# Altium schematic sheet FPGA_RGMII_Misc.SchDoc
size A3
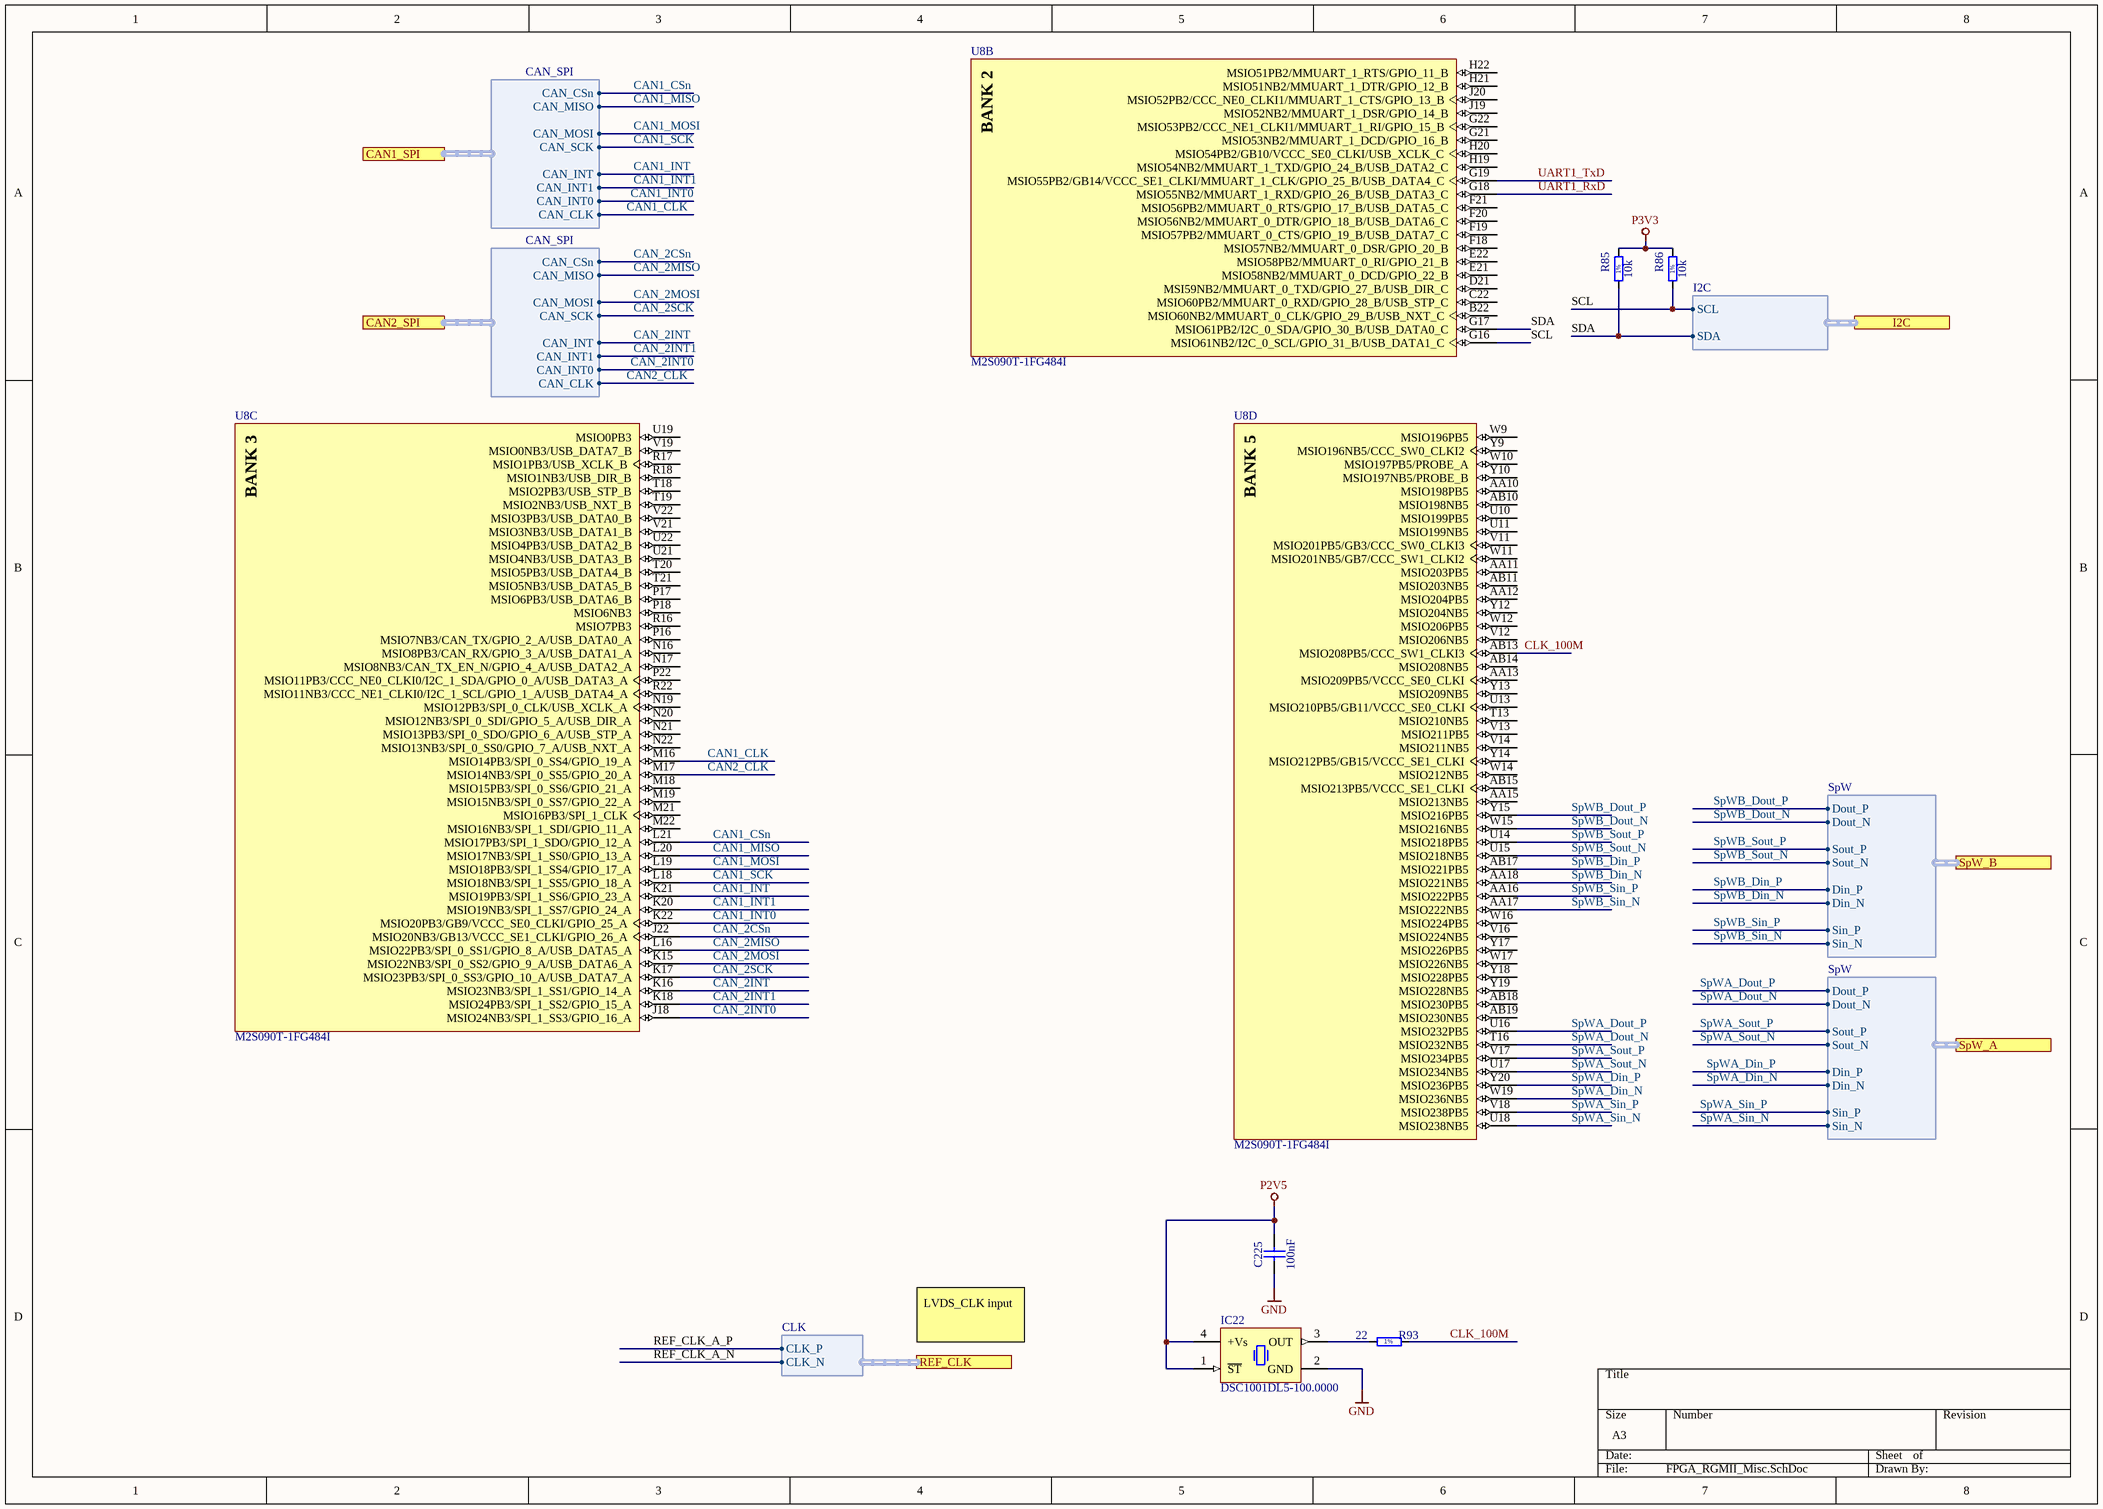
[diagram p0: FPGA_RGMII_Misc.SchDoc]

## Parts
C225  100nF  [CAPC0603X33N]
IC22  DSC1001DL5-100.0000  [OSC_MICREL_2520]
R85  10k  [RESC1005X40N]
R86  10k  [RESC1005X40N]
R93  22  [RESC1005X40N]
U8  M2S090T-1FG484I  [MCSM-FG-484_V]  (parts B,C,D of 15)

## Ports
CAN1_SPI (harness CAN_SPI), CAN2_SPI (harness CAN_SPI), I2C (harness I2C), REF_CLK (harness CLK), SpW_A (harness SpW), SpW_B (harness SpW)

## Harnesses
SpW: Sout_P, Sout_N, Dout_P, Dout_N, Sin_P, Sin_N, Din_P, Din_N
CLK: CLK_P, CLK_N
CAN_SPI: CAN_INT1, CAN_INT, CAN_INT0, CAN_SCK, CAN_MOSI, CAN_MISO, CAN_CSn, CAN_CLK
I2C: SCL, SDA

## Nets
GND: C225.1 IC22.2(GND)
P2V5: C225.2 IC22.1(~{ST}) IC22.4(+Vs)
P3V3: R85.2 R86.2
CAN1_CLK: U8.M16(MSIO14PB3/SPI_0_SS4/GPIO_19_A) ; port CAN1_SPI.CAN_CLK
CAN1_CSn: U8.L21(MSIO17PB3/SPI_1_SDO/GPIO_12_A) ; port CAN1_SPI.CAN_CSn
CAN1_INT: U8.K21(MSIO19PB3/SPI_1_SS6/GPIO_23_A) ; port CAN1_SPI.CAN_INT
CAN1_INT0: U8.K22(MSIO20PB3/GB9/VCCC_SE0_CLKI/GPIO_25_A) ; port CAN1_SPI.CAN_INT0
CAN1_INT1: U8.K20(MSIO19NB3/SPI_1_SS7/GPIO_24_A) ; port CAN1_SPI.CAN_INT1
CAN1_MISO: U8.L20(MSIO17NB3/SPI_1_SS0/GPIO_13_A) ; port CAN1_SPI.CAN_MISO
CAN1_MOSI: U8.L19(MSIO18PB3/SPI_1_SS4/GPIO_17_A) ; port CAN1_SPI.CAN_MOSI
CAN1_SCK: U8.L18(MSIO18NB3/SPI_1_SS5/GPIO_18_A) ; port CAN1_SPI.CAN_SCK
CAN2_CLK: U8.M17(MSIO14NB3/SPI_0_SS5/GPIO_20_A) ; port CAN2_SPI.CAN_CLK
CAN_2CSn: U8.J22(MSIO20NB3/GB13/VCCC_SE1_CLKI/GPIO_26_A) ; port CAN2_SPI.CAN_CSn
CAN_2INT: U8.K16(MSIO23NB3/SPI_1_SS1/GPIO_14_A) ; port CAN2_SPI.CAN_INT
CAN_2INT0: U8.J18(MSIO24NB3/SPI_1_SS3/GPIO_16_A) ; port CAN2_SPI.CAN_INT0
CAN_2INT1: U8.K18(MSIO24PB3/SPI_1_SS2/GPIO_15_A) ; port CAN2_SPI.CAN_INT1
CAN_2MISO: U8.L16(MSIO22PB3/SPI_0_SS1/GPIO_8_A/USB_DATA5_A) ; port CAN2_SPI.CAN_MISO
CAN_2MOSI: U8.K15(MSIO22NB3/SPI_0_SS2/GPIO_9_A/USB_DATA6_A) ; port CAN2_SPI.CAN_MOSI
CAN_2SCK: U8.K17(MSIO23PB3/SPI_0_SS3/GPIO_10_A/USB_DATA7_A) ; port CAN2_SPI.CAN_SCK
CLK_100M: R93.2 U8.AB13(MSIO208PB5/CCC_SW1_CLKI3)
REF_CLK_A_N: port REF_CLK.CLK_N
REF_CLK_A_P: port REF_CLK.CLK_P
SCL: R86.1 U8.G16(MSIO61NB2/I2C_0_SCL/GPIO_31_B/USB_DATA1_C) ; port I2C.SCL
SDA: R85.1 U8.G17(MSIO61PB2/I2C_0_SDA/GPIO_30_B/USB_DATA0_C) ; port I2C.SDA
SpWA_Din_N: U8.W19(MSIO236NB5) ; port SpW_A.Din_N
SpWA_Din_P: U8.Y20(MSIO236PB5) ; port SpW_A.Din_P
SpWA_Dout_N: U8.T16(MSIO232NB5) ; port SpW_A.Dout_N
SpWA_Dout_P: U8.U16(MSIO232PB5) ; port SpW_A.Dout_P
SpWA_Sin_N: U8.U18(MSIO238NB5) ; port SpW_A.Sin_N
SpWA_Sin_P: U8.V18(MSIO238PB5) ; port SpW_A.Sin_P
SpWA_Sout_N: U8.U17(MSIO234NB5) ; port SpW_A.Sout_N
SpWA_Sout_P: U8.V17(MSIO234PB5) ; port SpW_A.Sout_P
SpWB_Din_N: U8.AA18(MSIO221NB5) ; port SpW_B.Din_N
SpWB_Din_P: U8.AB17(MSIO221PB5) ; port SpW_B.Din_P
SpWB_Dout_N: U8.W15(MSIO216NB5) ; port SpW_B.Dout_N
SpWB_Dout_P: U8.Y15(MSIO216PB5) ; port SpW_B.Dout_P
SpWB_Sin_N: U8.AA17(MSIO222NB5) ; port SpW_B.Sin_N
SpWB_Sin_P: U8.AA16(MSIO222PB5) ; port SpW_B.Sin_P
SpWB_Sout_N: U8.U15(MSIO218NB5) ; port SpW_B.Sout_N
SpWB_Sout_P: U8.U14(MSIO218PB5) ; port SpW_B.Sout_P
UART1_RxD: U8.G18(MSIO55NB2/MMUART_1_RXD/GPIO_26_B/USB_DATA3_C)
UART1_TxD: U8.G19(MSIO55PB2/GB14/VCCC_SE1_CLKI/MMUART_1_CLK/GPIO_25_B/USB_DATA4_C)
NetIC22_3: IC22.3(OUT) R93.1

Not connected (* = marked no-connect by the designer): U8 AA10(MSIO198PB5) AA11(MSIO203PB5) AA12(MSIO204PB5) AA13(MSIO209PB5/VCCC_SE0_CLKI) AA15(MSIO213NB5) AB10(MSIO198NB5) AB11(MSIO203NB5) AB14(MSIO208NB5) AB15(MSIO213PB5/VCCC_SE1_CLKI) AB18(MSIO230PB5) AB19(MSIO230NB5) B22(MSIO60NB2/MMUART_0_CLK/GPIO_29_B/USB_NXT_C) C22(MSIO60PB2/MMUART_0_RXD/GPIO_28_B/USB_STP_C) D21(MSI59NB2/MMUART_0_TXD/GPIO_27_B/USB_DIR_C) E21(MSIO58NB2/MMUART_0_DCD/GPIO_22_B) E22(MSIO58PB2/MMUART_0_RI/GPIO_21_B) F18(MSIO57NB2/MMUART_0_DSR/GPIO_20_B) F19(MSIO57PB2/MMUART_0_CTS/GPIO_19_B/USB_DATA7_C) F20(MSIO56NB2/MMUART_0_DTR/GPIO_18_B/USB_DATA6_C) F21(MSIO56PB2/MMUART_0_RTS/GPIO_17_B/USB_DATA5_C) G21(MSIO53NB2/MMUART_1_DCD/GPIO_16_B) G22(MSIO53PB2/CCC_NE1_CLKI1/MMUART_1_RI/GPIO_15_B) H19(MSIO54NB2/MMUART_1_TXD/GPIO_24_B/USB_DATA2_C) H20(MSIO54PB2/GB10/VCCC_SE0_CLKI/USB_XCLK_C) H21(MSIO51NB2/MMUART_1_DTR/GPIO_12_B) H22(MSIO51PB2/MMUART_1_RTS/GPIO_11_B) J19(MSIO52NB2/MMUART_1_DSR/GPIO_14_B) J20(MSIO52PB2/CCC_NE0_CLKI1/MMUART_1_CTS/GPIO_13_B) M18(MSIO15PB3/SPI_0_SS6/GPIO_21_A) M19(MSIO15NB3/SPI_0_SS7/GPIO_22_A) M21(MSIO16PB3/SPI_1_CLK) M22(MSIO16NB3/SPI_1_SDI/GPIO_11_A) N16(MSIO8PB3/CAN_RX/GPIO_3_A/USB_DATA1_A) N17(MSIO8NB3/CAN_TX_EN_N/GPIO_4_A/USB_DATA2_A) N19(MSIO12PB3/SPI_0_CLK/USB_XCLK_A) N20(MSIO12NB3/SPI_0_SDI/GPIO_5_A/USB_DIR_A) N21(MSIO13PB3/SPI_0_SDO/GPIO_6_A/USB_STP_A) N22(MSIO13NB3/SPI_0_SS0/GPIO_7_A/USB_NXT_A) P16(MSIO7NB3/CAN_TX/GPIO_2_A/USB_DATA0_A) P17(MSIO6PB3/USB_DATA6_B) P18(MSIO6NB3) P22(MSIO11PB3/CCC_NE0_CLKI0/I2C_1_SDA/GPIO_0_A/USB_DATA3_A) R16(MSIO7PB3) R17(MSIO1PB3/USB_XCLK_B) R18(MSIO1NB3/USB_DIR_B) R22(MSIO11NB3/CCC_NE1_CLKI0/I2C_1_SCL/GPIO_1_A/USB_DATA4_A) T13(MSIO210NB5) T18(MSIO2PB3/USB_STP_B) T19(MSIO2NB3/USB_NXT_B) T20(MSIO5PB3/USB_DATA4_B) T21(MSIO5NB3/USB_DATA5_B) U10(MSIO199PB5) U11(MSIO199NB5) U13(MSIO210PB5/GB11/VCCC_SE0_CLKI) U19(MSIO0PB3) U21(MSIO4NB3/USB_DATA3_B) U22(MSIO4PB3/USB_DATA2_B) V11(MSIO201PB5/GB3/CCC_SW0_CLKI3) V12(MSIO206NB5) V13(MSIO211PB5) V14(MSIO211NB5) V16(MSIO224NB5) V19(MSIO0NB3/USB_DATA7_B) V21(MSIO3NB3/USB_DATA1_B) V22(MSIO3PB3/USB_DATA0_B) W9(MSIO196PB5) W10(MSIO197PB5/PROBE_A) W11(MSIO201NB5/GB7/CCC_SW1_CLKI2) W12(MSIO206PB5) W14(MSIO212NB5) W16(MSIO224PB5) W17(MSIO226NB5) Y9(MSIO196NB5/CCC_SW0_CLKI2) Y10(MSIO197NB5/PROBE_B) Y12(MSIO204NB5) Y13(MSIO209NB5) Y14(MSIO212PB5/GB15/VCCC_SE1_CLKI) Y17(MSIO226PB5) Y18(MSIO228PB5) Y19(MSIO228NB5)

## Notes on the sheet
- LVDS_CLK input
- (in symbol CMP-0959-00045-1, part B) BANK 2
- (in symbol CMP-0959-00045-1, part C) BANK 3
- (in symbol CMP-0959-00045-1, part D) BANK 5
- (in symbol R0402_10K_1%_0.0625W_100PPM) 1%
- (in symbol R0402_22R_1%_0.0625W_100PPM) 1%

## Library data of the parts
C225 = CC0201_100NF_6.3V_10%_X5R: Non-polarised capacitor; Manufacturer: GENERIC; Part Description: SMD Multilayer Chip Ceramic Capacitor; Manufacturer1 Part Number: 02016D104KAT2A; Voltage: 6.3V; TC: X5R; Tolerance: ±10%; Part Number: CC0201_100NF_6.3V_10%_X5R; Component Kind: Standard; Component Type: Standard; Pin Count: 2; Value: 100nF; Status: Not Recommended; Manufacturer Part Number: CC0201_100NF_6.3V_10%_X5R; Case: 0201; Mounted: Yes; Socket: No; SMD: Yes; Sense: No; Manufacturer1 Example: AVX; Manufacturer1 ComponentHeight: 0.33mm; HelpURL: \\cern.ch\dfs\Applications\Altium\Datasheets\CC0201_X5R_AVX.pdf; Author: CERN DEM JLC; CreateDate: 03/12/2007; LatestRevisionDate: 03/12/2007
IC22 = OSC_DSC1001DL5-100.0000: MEMS 100MHz oscillator; Manufacturer: Micrel; Part Description: MEMS Oscillator 100MHz; Bonding: No; PressFit: No; Case: *; Component Kind: Standard; Component Type: Standard; ComponentHeigth: *; CreateDate: 2018-01-01; Device: DSC1001DL5-100.0000; Footprint: *; HelpURL: *; LatestRevisionDate: 2018-01-01; Manufacturer Part Number: DSC1001DL5-100.0000; Mounted: Yes; PackageDescription: MICREL SMD Oscillator, QFN, 4 pins, 2.5mm x 2.0mm; Part Number: DSC1001DL5-100.0000; Pin Count: 4; Sense: No; SMD: Yes; Socket: No; Value: *
R85 R86 = R0402_10K_1%_0.0625W_100PPM: Resistor - 1%; Manufacturer: GENERIC; Part Description: General Purpose Thick Film Chip Resistor; Manufacturer1 Part Number: 232270671003L; TC: ±100ppm/°C; PressFit: No; Manufacturer Part Number: R0402_10K_1%_0.0625W_100PPM; Part Number: R0402_10K_1%_0.0625W_100PPM; Tolerance: ±1%; Value: 10k; Component Kind: Standard; Component Type: Standard; Pin Count: 2; Status: Not Recommended; Power: 0.0625W; Case: 0402; Mounted: Yes; Sense: No; Socket: No; SMD: Yes; Manufacturer1 Example: YAGEO PHYCOMP; Manufacturer1 ComponentHeight: 0.4mm; HelpURL: \\cern.ch\dfs\Applications\Altium\Datasheets\R0402_Phycomp_RC0402.pdf; Author: CERN DEM JLC; CreateDate: 03/12/2007; LatestRevisionDate: 17/10/2012
R93 = R0402_22R_1%_0.0625W_100PPM: Resistor - 1%; Part Description: General Purpose Thick Film Chip Resistor; Manufacturer: GENERIC; Manufacturer1 Part Number: 232270672209L; TC: ±100ppm/°C; PressFit: No; Part Number: R0402_22R_1%_0.0625W_100PPM; Component Kind: Standard; Component Type: Standard; Pin Count: 2; Value: 22; Status: Not Recommended; Power: 0.0625W; Tolerance: ±1%; Manufacturer Part Number: R0402_22R_1%_0.0625W_100PPM; Case: 0402; Mounted: Yes; Sense: No; Socket: No; SMD: Yes; Manufacturer1 Example: YAGEO PHYCOMP; Manufacturer1 ComponentHeight: 0.4mm; HelpURL: \\cern.ch\dfs\Applications\Altium\Datasheets\R0402_Phycomp_RC0402.pdf; Author: CERN DEM JLC; CreateDate: 03/12/2007; LatestRevisionDate: 17/10/2012
U8 = CMP-0959-00045-1: SmartFusion2 SoC FPGA, ARM Cortex-M3, 90 K LUTs, 267 User I/O, Transceiver Available, Design Security, Speed Grade 1, -40 to 100 degC, 484-Ball BGA; Manufacturer: Microsemi; Total User I/O: 267; PLLs and CCCs: 6; LSRAM 18K Blocks: 109; eNVM (K Bytes): 512; DDR Controllers (Count x Width): 1x18; Math Blocks (18x18): 84; Maximum Logic Elements: 86,316; eSRAM (K Bytes): 64; MSIOD (2.5V): 40; SERDES Lanes: 4; MSIO (3.3V): 157; Total RAM (K bits): 2074; DDRIO (2.5V): 70; uSRAM1K Blocks: 112; eSRAM (K Bytes) Non SECDED: 80; ComponentLink3URL: http://www.microsemi.com/document-portal/doc_download/131095-package-mechanical-drawings; DatasheetVersion: Rev. 5; ComponentLink3Description: Package Specification; ComponentLink1Description: Manufacturer URL; PackageReference: FG-484; RoHS: FALSE; ComponentLink1URL: http://www.microsemi.com/; Code_JEDEC: MS-034; Mounting Technology: Surface Mount; PackageDescription: 484-Ball Fine Pitch Plastic Ball Grid Array (FBGA), Body 23 x 23 mm, Pitch 1 mm; PackageVersion: Rev. 48, 11/2013; ComponentLink2URL: http://www.microsemi.com/document-portal/doc_download/130717-smartfusion2-datasheet; PartNumber: M2S090T-1FG484I; ComponentLink2Description: Datasheet; PartId: 1